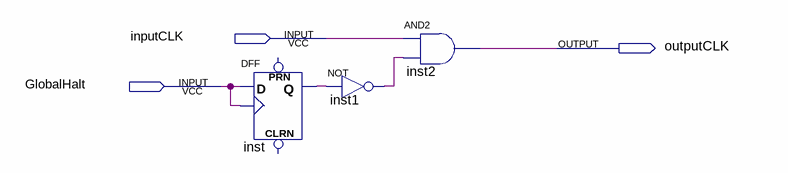
[diagram p0: schematic sheet]
// Quartus schematic ClkController.bdf as structural Verilog: 3 symbols, 3 pins
module ClkController (
  input  inputCLK,
  input  GlobalHalt,
  output outputCLK
);

  wire inst1_out, inst_q;

  DFF inst (.CLK(GlobalHalt), .D(GlobalHalt), .Q(inst_q));  // open: CLRN, PRN
  not inst1 (inst1_out, inst_q);
  and inst2 (outputCLK, inputCLK, inst1_out);
endmodule
